# Altium schematic sheet Top_Level.SchDoc
size A3; DocumentNumber: 1; SheetNumber: 1; SheetTotal: 5
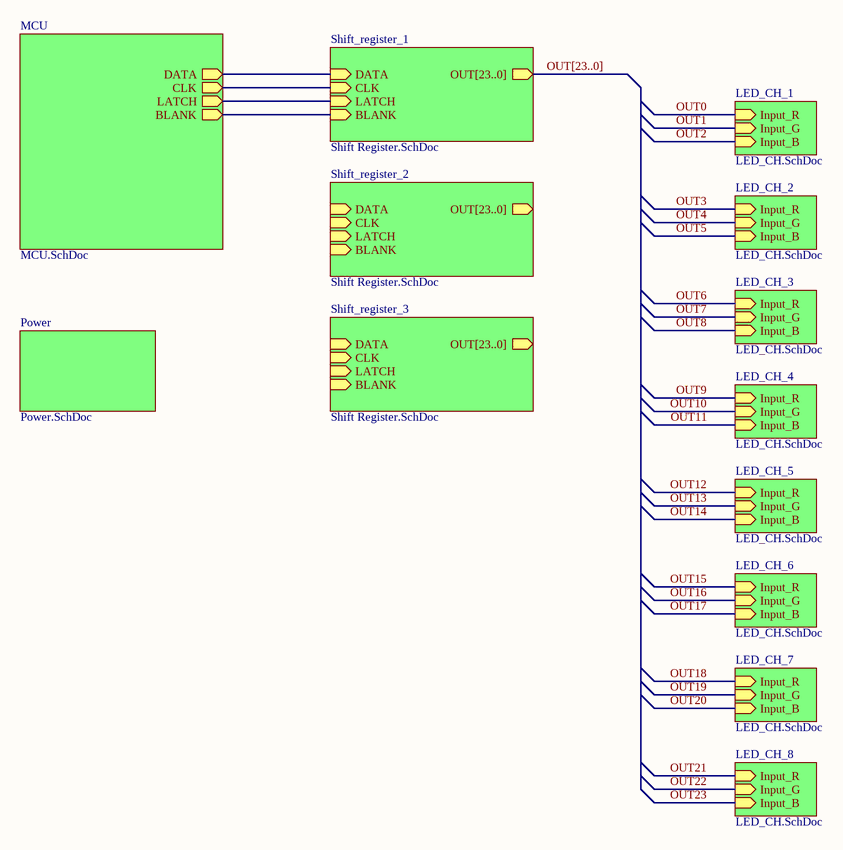
[diagram p0: Top_Level.SchDoc]

## Sub-sheets
LED_CH_1 = LED_CH.SchDoc: Input_G (in), Input_B (in), Input_R (in)
LED_CH_2 = LED_CH.SchDoc: Input_G (in), Input_B (in), Input_R (in)
LED_CH_3 = LED_CH.SchDoc: Input_G (in), Input_B (in), Input_R (in)
LED_CH_4 = LED_CH.SchDoc: Input_G (in), Input_B (in), Input_R (in)
LED_CH_5 = LED_CH.SchDoc: Input_G (in), Input_B (in), Input_R (in)
LED_CH_6 = LED_CH.SchDoc: Input_G (in), Input_B (in), Input_R (in)
LED_CH_7 = LED_CH.SchDoc: Input_G (in), Input_B (in), Input_R (in)
LED_CH_8 = LED_CH.SchDoc: Input_G (in), Input_B (in), Input_R (in)
MCU = MCU.SchDoc: DATA (out), CLK (out), LATCH (out), BLANK (out)
Power = Power.SchDoc: no entries
Shift_register_1 = Shift Register.SchDoc: DATA (in), CLK (in), LATCH (in), BLANK (in), OUT[23..0] (out)
Shift_register_2 = Shift Register.SchDoc: DATA (in), CLK (in), LATCH (in), BLANK (in), OUT[23..0] (out)
Shift_register_3 = Shift Register.SchDoc: DATA (in), CLK (in), LATCH (in), BLANK (in), OUT[23..0] (out)

## Nets
OUT0: sheet LED_CH_1/Input_R
OUT1: sheet LED_CH_1/Input_G
OUT2: sheet LED_CH_1/Input_B
OUT3: sheet LED_CH_2/Input_R
OUT4: sheet LED_CH_2/Input_G
OUT5: sheet LED_CH_2/Input_B
OUT6: sheet LED_CH_3/Input_R
OUT7: sheet LED_CH_3/Input_G
OUT8: sheet LED_CH_3/Input_B
OUT9: sheet LED_CH_4/Input_R
OUT10: sheet LED_CH_4/Input_G
OUT11: sheet LED_CH_4/Input_B
OUT12: sheet LED_CH_5/Input_R
OUT13: sheet LED_CH_5/Input_G
OUT14: sheet LED_CH_5/Input_B
OUT15: sheet LED_CH_6/Input_R
OUT16: sheet LED_CH_6/Input_G
OUT17: sheet LED_CH_6/Input_B
OUT18: sheet LED_CH_7/Input_R
OUT19: sheet LED_CH_7/Input_G
OUT20: sheet LED_CH_7/Input_B
OUT21: sheet LED_CH_8/Input_R
OUT22: sheet LED_CH_8/Input_G
OUT23: sheet LED_CH_8/Input_B
(unnamed): sheet MCU/DATA, sheet Shift_register_1/DATA
(unnamed): sheet MCU/CLK, sheet Shift_register_1/CLK
(unnamed): sheet MCU/LATCH, sheet Shift_register_1/LATCH
(unnamed): sheet MCU/BLANK, sheet Shift_register_1/BLANK

## Buses and harness runs
bus OUT[23..0] = sheet Shift_register_1/OUT[23..0]

## Notes on the sheet
- Title:
- Author:
- Approved:
- Size:
- Date:
- Git Hash:
- A3
- Prj:
- SW Version:
- Variant:
- Edited:
- CONFIDENTIAL
- File: